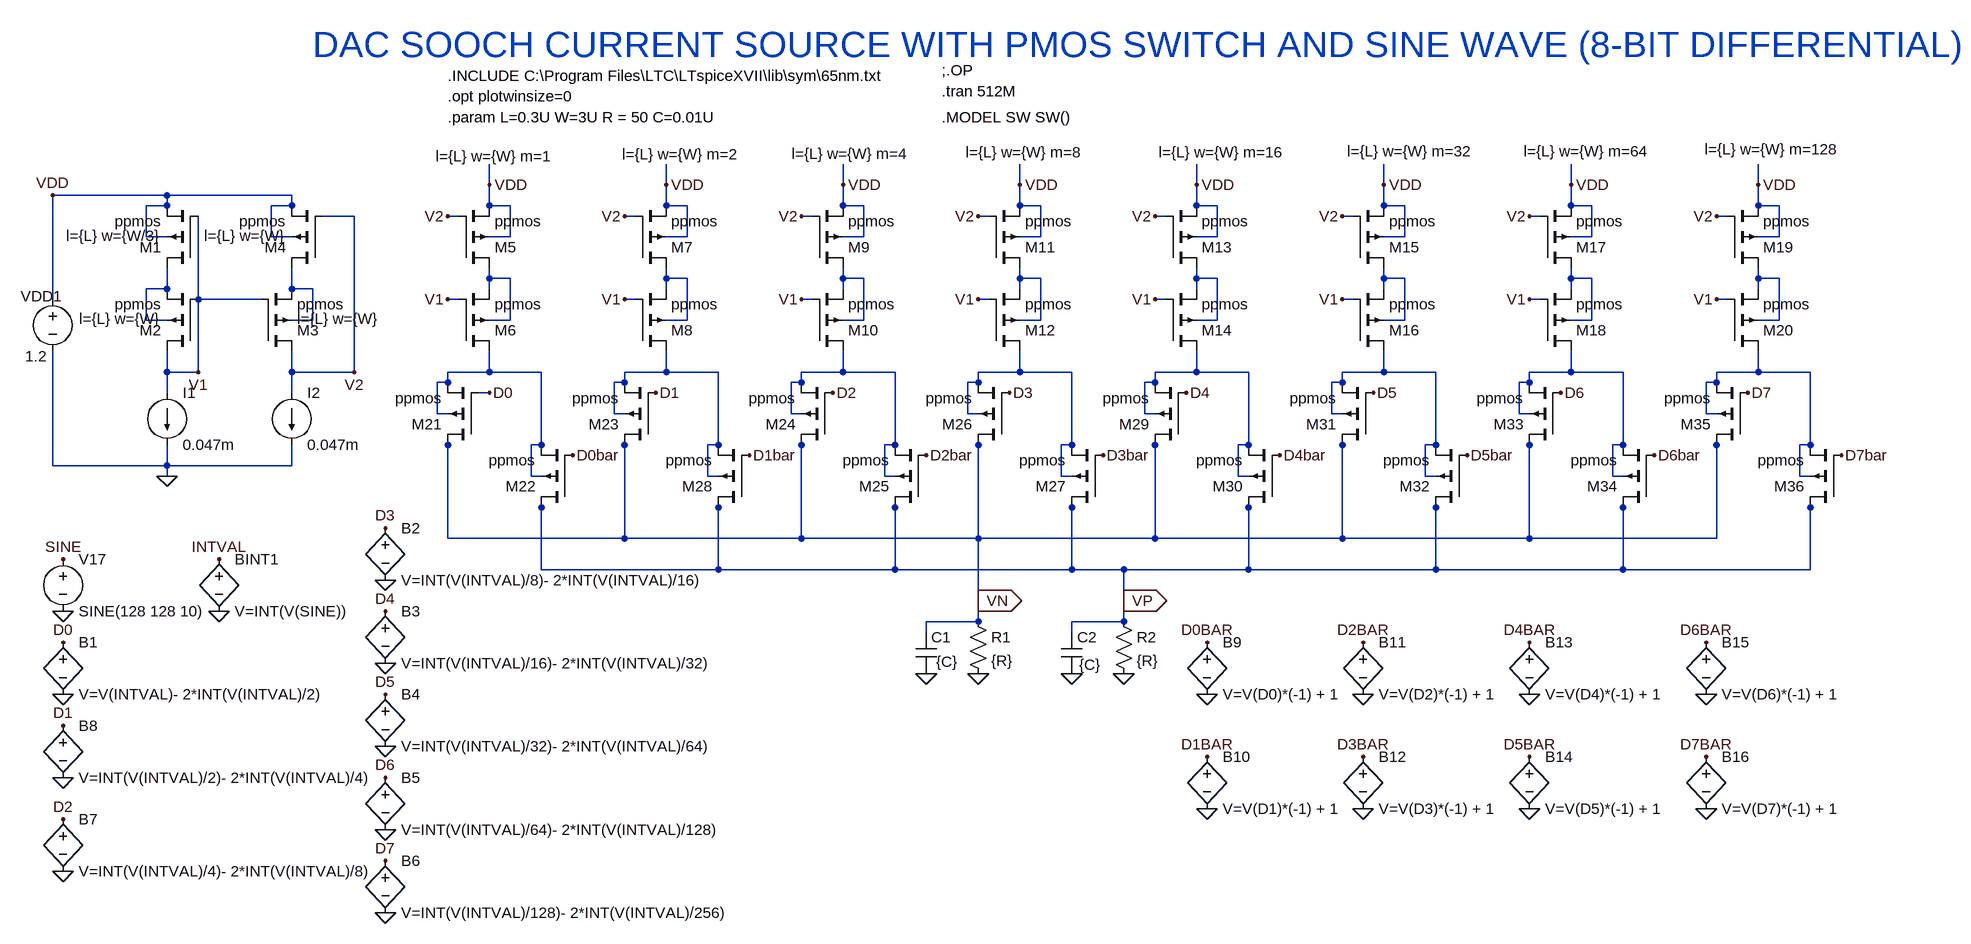
[diagram p0: schematic 107DAC_DIFF_SOOCH_PMOS_SW_SINE_8BIT.asc]
107DAC_DIFF_SOOCH_PMOS_SW_SINE_8BIT.asc, the LTspice schematic file:
Version 4
SHEET 1 1344 1360
WIRE -960 -448 -960 -480
WIRE -688 -448 -688 -480
WIRE -416 -448 -416 -480
WIRE -144 -448 -144 -480
WIRE 128 -448 128 -480
WIRE 416 -448 416 -480
WIRE 704 -448 704 -480
WIRE 992 -448 992 -480
WIRE -1456 -432 -1632 -432
WIRE -1264 -432 -1456 -432
WIRE -1456 -416 -1456 -432
WIRE -1456 -416 -1488 -416
WIRE -1264 -416 -1264 -432
WIRE -1264 -416 -1296 -416
WIRE -960 -416 -960 -448
WIRE -928 -416 -960 -416
WIRE -688 -416 -688 -448
WIRE -656 -416 -688 -416
WIRE -416 -416 -416 -448
WIRE -384 -416 -416 -416
WIRE -144 -416 -144 -448
WIRE -112 -416 -144 -416
WIRE 128 -416 128 -448
WIRE 160 -416 128 -416
WIRE 416 -416 416 -448
WIRE 448 -416 416 -416
WIRE 704 -416 704 -448
WIRE 736 -416 704 -416
WIRE 992 -416 992 -448
WIRE 1024 -416 992 -416
WIRE -1168 -400 -1216 -400
WIRE -1008 -400 -1024 -400
WIRE -736 -400 -752 -400
WIRE -464 -400 -480 -400
WIRE -192 -400 -208 -400
WIRE 80 -400 64 -400
WIRE 368 -400 352 -400
WIRE 656 -400 640 -400
WIRE 944 -400 928 -400
WIRE -1488 -368 -1488 -416
WIRE -1456 -368 -1488 -368
WIRE -1296 -368 -1296 -416
WIRE -1264 -368 -1296 -368
WIRE -928 -368 -928 -416
WIRE -928 -368 -960 -368
WIRE -656 -368 -656 -416
WIRE -656 -368 -688 -368
WIRE -384 -368 -384 -416
WIRE -384 -368 -416 -368
WIRE -112 -368 -112 -416
WIRE -112 -368 -144 -368
WIRE 160 -368 160 -416
WIRE 160 -368 128 -368
WIRE 448 -368 448 -416
WIRE 448 -368 416 -368
WIRE 736 -368 736 -416
WIRE 736 -368 704 -368
WIRE 1024 -368 1024 -416
WIRE 1024 -368 992 -368
WIRE -960 -304 -960 -320
WIRE -928 -304 -960 -304
WIRE -688 -304 -688 -320
WIRE -656 -304 -688 -304
WIRE -416 -304 -416 -320
WIRE -384 -304 -416 -304
WIRE -144 -304 -144 -320
WIRE -112 -304 -144 -304
WIRE 128 -304 128 -320
WIRE 160 -304 128 -304
WIRE 416 -304 416 -320
WIRE 448 -304 416 -304
WIRE 704 -304 704 -320
WIRE 736 -304 704 -304
WIRE 992 -304 992 -320
WIRE 1024 -304 992 -304
WIRE -1456 -288 -1456 -320
WIRE -1456 -288 -1488 -288
WIRE -1264 -288 -1264 -320
WIRE -1232 -288 -1264 -288
WIRE -960 -288 -960 -304
WIRE -688 -288 -688 -304
WIRE -416 -288 -416 -304
WIRE -144 -288 -144 -304
WIRE 128 -288 128 -304
WIRE 416 -288 416 -304
WIRE 704 -288 704 -304
WIRE 992 -288 992 -304
WIRE -1632 -272 -1632 -432
WIRE -1408 -272 -1408 -400
WIRE -1312 -272 -1408 -272
WIRE -1008 -272 -1024 -272
WIRE -736 -272 -752 -272
WIRE -464 -272 -480 -272
WIRE -192 -272 -208 -272
WIRE 80 -272 64 -272
WIRE 368 -272 352 -272
WIRE 656 -272 640 -272
WIRE 944 -272 928 -272
WIRE -1488 -240 -1488 -288
WIRE -1456 -240 -1488 -240
WIRE -1232 -240 -1232 -288
WIRE -1232 -240 -1264 -240
WIRE -928 -240 -928 -304
WIRE -928 -240 -960 -240
WIRE -656 -240 -656 -304
WIRE -656 -240 -688 -240
WIRE -384 -240 -384 -304
WIRE -384 -240 -416 -240
WIRE -112 -240 -112 -304
WIRE -112 -240 -144 -240
WIRE 160 -240 160 -304
WIRE 160 -240 128 -240
WIRE 448 -240 448 -304
WIRE 448 -240 416 -240
WIRE 736 -240 736 -304
WIRE 736 -240 704 -240
WIRE 1024 -240 1024 -304
WIRE 1024 -240 992 -240
WIRE -1456 -160 -1456 -192
WIRE -1408 -160 -1408 -272
WIRE -1408 -160 -1456 -160
WIRE -1264 -160 -1264 -192
WIRE -1168 -160 -1168 -400
WIRE -1168 -160 -1264 -160
WIRE -960 -160 -960 -192
WIRE -960 -160 -1024 -160
WIRE -880 -160 -960 -160
WIRE -688 -160 -688 -192
WIRE -688 -160 -752 -160
WIRE -608 -160 -688 -160
WIRE -416 -160 -416 -192
WIRE -416 -160 -480 -160
WIRE -336 -160 -416 -160
WIRE -144 -160 -144 -192
WIRE -144 -160 -208 -160
WIRE -64 -160 -144 -160
WIRE 128 -160 128 -192
WIRE 128 -160 64 -160
WIRE 208 -160 128 -160
WIRE 416 -160 416 -192
WIRE 416 -160 352 -160
WIRE 496 -160 416 -160
WIRE 704 -160 704 -192
WIRE 704 -160 640 -160
WIRE 784 -160 704 -160
WIRE 992 -160 992 -192
WIRE 992 -160 928 -160
WIRE 1072 -160 992 -160
WIRE -1024 -144 -1024 -160
WIRE -1024 -144 -1040 -144
WIRE -752 -144 -752 -160
WIRE -752 -144 -768 -144
WIRE -480 -144 -480 -160
WIRE -480 -144 -496 -144
WIRE -208 -144 -208 -160
WIRE -208 -144 -224 -144
WIRE 64 -144 64 -160
WIRE 64 -144 48 -144
WIRE 352 -144 352 -160
WIRE 352 -144 336 -144
WIRE 640 -144 640 -160
WIRE 640 -144 624 -144
WIRE 928 -144 928 -160
WIRE 928 -144 912 -144
WIRE -1456 -128 -1456 -160
WIRE -1264 -128 -1264 -160
WIRE -960 -128 -976 -128
WIRE -1040 -96 -1040 -144
WIRE -1024 -96 -1040 -96
WIRE -768 -96 -768 -144
WIRE -752 -96 -768 -96
WIRE -496 -96 -496 -144
WIRE -480 -96 -496 -96
WIRE -224 -96 -224 -144
WIRE -208 -96 -224 -96
WIRE 48 -96 48 -144
WIRE 64 -96 48 -96
WIRE 336 -96 336 -144
WIRE 352 -96 336 -96
WIRE 624 -96 624 -144
WIRE 640 -96 624 -96
WIRE 912 -96 912 -144
WIRE 928 -96 912 -96
WIRE -1024 -48 -1024 -64
WIRE -880 -48 -880 -160
WIRE -880 -48 -896 -48
WIRE -752 -48 -752 -64
WIRE -608 -48 -608 -160
WIRE -608 -48 -624 -48
WIRE -480 -48 -480 -64
WIRE -336 -48 -336 -160
WIRE -336 -48 -352 -48
WIRE -208 -48 -208 -64
WIRE -64 -48 -64 -160
WIRE -64 -48 -80 -48
WIRE 64 -48 64 -64
WIRE 208 -48 208 -160
WIRE 208 -48 192 -48
WIRE 352 -48 352 -64
WIRE 496 -48 496 -160
WIRE 496 -48 480 -48
WIRE 640 -48 640 -64
WIRE 784 -48 784 -160
WIRE 784 -48 768 -48
WIRE 928 -48 928 -64
WIRE 1072 -48 1072 -160
WIRE 1072 -48 1056 -48
WIRE -1632 -16 -1632 -192
WIRE -1456 -16 -1456 -48
WIRE -1456 -16 -1632 -16
WIRE -1264 -16 -1264 -48
WIRE -1264 -16 -1456 -16
WIRE -1456 0 -1456 -16
WIRE -896 0 -896 -48
WIRE -880 0 -896 0
WIRE -624 0 -624 -48
WIRE -608 0 -624 0
WIRE -352 0 -352 -48
WIRE -336 0 -352 0
WIRE -80 0 -80 -48
WIRE -64 0 -80 0
WIRE 192 0 192 -48
WIRE 208 0 192 0
WIRE 480 0 480 -48
WIRE 496 0 480 0
WIRE 768 0 768 -48
WIRE 784 0 768 0
WIRE 1056 0 1056 -48
WIRE 1072 0 1056 0
WIRE -880 48 -880 32
WIRE -608 48 -608 32
WIRE -336 48 -336 32
WIRE -64 48 -64 32
WIRE 208 48 208 32
WIRE 496 48 496 32
WIRE 784 48 784 32
WIRE 1072 48 1072 32
WIRE -1024 96 -1024 -48
WIRE -752 96 -752 -48
WIRE -752 96 -1024 96
WIRE -480 96 -480 -48
WIRE -480 96 -752 96
WIRE -208 96 -208 -48
WIRE -208 96 -480 96
WIRE 64 96 64 -48
WIRE 64 96 -208 96
WIRE 352 96 352 -48
WIRE 352 96 64 96
WIRE 640 96 640 -48
WIRE 640 96 352 96
WIRE 928 96 928 -48
WIRE 928 96 640 96
WIRE -880 144 -880 48
WIRE -608 144 -608 48
WIRE -608 144 -880 144
WIRE -336 144 -336 48
WIRE -336 144 -608 144
WIRE -64 144 -64 48
WIRE -64 144 -336 144
WIRE 16 144 -64 144
WIRE 208 144 208 48
WIRE 208 144 16 144
WIRE 496 144 496 48
WIRE 496 144 208 144
WIRE 784 144 784 48
WIRE 784 144 496 144
WIRE 1072 144 1072 48
WIRE 1072 144 784 144
WIRE -208 192 -208 96
WIRE 16 192 16 144
WIRE -208 224 -208 192
WIRE -208 224 -288 224
WIRE 16 224 16 192
WIRE 16 224 -64 224
WIRE -288 240 -288 224
WIRE -64 240 -64 224
FLAG -1408 -160 V1
FLAG -1024 -272 V1
FLAG -1168 -160 V2
FLAG -1024 -400 V2
FLAG -960 -448 VDD
FLAG -1632 -432 VDD
FLAG -752 -272 V1
FLAG -752 -400 V2
FLAG -688 -448 VDD
FLAG -480 -272 V1
FLAG -480 -400 V2
FLAG -416 -448 VDD
FLAG -208 -272 V1
FLAG -208 -400 V2
FLAG -144 -448 VDD
FLAG 64 -272 V1
FLAG 64 -400 V2
FLAG 128 -448 VDD
FLAG 352 -272 V1
FLAG 352 -400 V2
FLAG 416 -448 VDD
FLAG 640 -272 V1
FLAG 640 -400 V2
FLAG 704 -448 VDD
FLAG 928 -272 V1
FLAG 928 -400 V2
FLAG 992 -448 VDD
FLAG -208 304 0
FLAG -704 -128 D1
FLAG -432 -128 D2
FLAG -160 -128 D3
FLAG 112 -128 D4
FLAG 400 -128 D5
FLAG 688 -128 D6
FLAG 976 -128 D7
FLAG -1456 0 0
FLAG -288 304 0
FLAG -832 -32 D0bar
FLAG -560 -32 D1bar
FLAG -288 -32 D2bar
FLAG -16 -32 D3bar
FLAG 256 -32 D4bar
FLAG 544 -32 D5bar
FLAG 832 -32 D6bar
FLAG 1120 -32 D7bar
FLAG 16 304 0
FLAG 16 192 VP
IOPIN 16 192 Out
FLAG -64 304 0
FLAG -208 192 VN
IOPIN -208 192 Out
FLAG -960 -128 D0
FLAG -1616 208 0
FLAG -1616 128 SINE
FLAG -1376 208 0
FLAG -1376 128 INTVAL
FLAG -1616 256 D0
FLAG -1616 336 0
FLAG -1616 384 D1
FLAG -1616 528 D2
FLAG -1120 80 D3
FLAG -1120 208 D4
FLAG -1120 336 D5
FLAG -1120 464 D6
FLAG -1120 592 D7
FLAG -1120 160 0
FLAG -1120 288 0
FLAG -1120 416 0
FLAG -1120 544 0
FLAG -1120 672 0
FLAG -1616 608 0
FLAG -1616 464 0
FLAG 144 336 0
FLAG 144 256 D0BAR
FLAG 144 512 0
FLAG 144 432 D1BAR
FLAG 384 336 0
FLAG 384 256 D2BAR
FLAG 384 512 0
FLAG 384 432 D3BAR
FLAG 640 336 0
FLAG 640 256 D4BAR
FLAG 640 512 0
FLAG 640 432 D5BAR
FLAG 912 336 0
FLAG 912 256 D6BAR
FLAG 912 512 0
FLAG 912 432 D7BAR
SYMBOL pmos4 -1408 -320 R180
WINDOW 123 56 50 Left 2
SYMATTR Value2 l={L} w={W/3}
SYMATTR InstName M1
SYMATTR Value ppmos
SYMBOL pmos4 -1408 -192 R180
WINDOW 123 56 50 Left 2
SYMATTR Value2 l={L} w={W}
SYMATTR InstName M2
SYMATTR Value ppmos
SYMBOL current -1456 -128 R0
WINDOW 123 0 0 Left 0
WINDOW 39 0 0 Left 0
SYMATTR InstName I1
SYMATTR Value 0.047m
SYMBOL pmos4 -1312 -192 M180
WINDOW 123 56 50 Left 2
SYMATTR Value2 l={L} w={W}
SYMATTR InstName M3
SYMATTR Value ppmos
SYMBOL pmos4 -1216 -320 R180
WINDOW 123 56 50 Left 2
SYMATTR Value2 l={L} w={W}
SYMATTR InstName M4
SYMATTR Value ppmos
SYMBOL current -1264 -128 R0
WINDOW 123 0 0 Left 0
WINDOW 39 0 0 Left 0
SYMATTR InstName I2
SYMATTR Value 0.047m
SYMBOL pmos4 -1008 -320 M180
WINDOW 123 -35 172 Left 2
SYMATTR Value2 l={L} w={W} m=1
SYMATTR InstName M5
SYMATTR Value ppmos
SYMBOL pmos4 -1008 -192 M180
SYMATTR Value2 l={L} w={W} m=1
SYMATTR InstName M6
SYMATTR Value ppmos
SYMBOL voltage -1632 -288 R0
WINDOW 123 0 0 Left 0
WINDOW 39 0 0 Left 0
WINDOW 0 -49 11 Left 2
WINDOW 3 -42 104 Left 2
SYMATTR InstName VDD1
SYMATTR Value 1.2
SYMBOL pmos4 -736 -320 M180
WINDOW 123 -20 175 Left 2
SYMATTR Value2 l={L} w={W} m=2
SYMATTR InstName M7
SYMATTR Value ppmos
SYMBOL pmos4 -736 -192 M180
SYMATTR Value2 l={L} w={W} m=2
SYMATTR InstName M8
SYMATTR Value ppmos
SYMBOL pmos4 -464 -320 M180
WINDOW 123 -31 176 Left 2
SYMATTR Value2 l={L} w={W} m=4
SYMATTR InstName M9
SYMATTR Value ppmos
SYMBOL pmos4 -464 -192 M180
SYMATTR Value2 l={L} w={W} m=4
SYMATTR InstName M10
SYMATTR Value ppmos
SYMBOL pmos4 -192 -320 M180
WINDOW 123 -35 178 Left 2
SYMATTR Value2 l={L} w={W} m=8
SYMATTR InstName M11
SYMATTR Value ppmos
SYMBOL pmos4 -192 -192 M180
SYMATTR Value2 l={L} w={W} m=8
SYMATTR InstName M12
SYMATTR Value ppmos
SYMBOL pmos4 80 -320 M180
WINDOW 123 -10 178 Left 2
SYMATTR Value2 l={L} w={W} m=16
SYMATTR InstName M13
SYMATTR Value ppmos
SYMBOL pmos4 80 -192 M180
SYMATTR Value2 l={L} w={W} m=16
SYMATTR InstName M14
SYMATTR Value ppmos
SYMBOL pmos4 368 -320 M180
WINDOW 123 -8 180 Left 2
SYMATTR Value2 l={L} w={W} m=32
SYMATTR InstName M15
SYMATTR Value ppmos
SYMBOL pmos4 368 -192 M180
SYMATTR Value2 l={L} w={W} m=32
SYMATTR InstName M16
SYMATTR Value ppmos
SYMBOL pmos4 656 -320 M180
WINDOW 123 -25 180 Left 2
SYMATTR Value2 l={L} w={W} m=64
SYMATTR InstName M17
SYMATTR Value ppmos
SYMBOL pmos4 656 -192 M180
SYMATTR Value2 l={L} w={W} m=64
SYMATTR InstName M18
SYMATTR Value ppmos
SYMBOL pmos4 944 -320 M180
WINDOW 123 -34 183 Left 2
SYMATTR Value2 l={L} w={W} m=128
SYMATTR InstName M19
SYMATTR Value ppmos
SYMBOL pmos4 944 -192 M180
SYMATTR Value2 l={L} w={W} m=128
SYMATTR InstName M20
SYMATTR Value ppmos
SYMBOL res -224 208 R0
SYMATTR InstName R1
SYMATTR Value {R}
SYMBOL cap -304 240 R0
WINDOW 3 31 46 Left 2
SYMATTR Value {C}
SYMATTR InstName C1
SYMBOL res 0 208 R0
SYMATTR InstName R2
SYMATTR Value {R}
SYMBOL cap -80 240 R0
WINDOW 3 27 50 Left 2
SYMATTR Value {C}
SYMATTR InstName C2
SYMBOL pmos4 -976 -48 R180
SYMATTR Value2 l={L} w={W} m=1
SYMATTR InstName M21
SYMATTR Value ppmos
SYMBOL pmos4 -832 48 R180
SYMATTR Value2 l={L} w={W} m=1
SYMATTR InstName M22
SYMATTR Value ppmos
SYMBOL pmos4 -704 -48 R180
SYMATTR Value2 l={L} w={W} m=2
SYMATTR InstName M23
SYMATTR Value ppmos
SYMBOL pmos4 -432 -48 R180
SYMATTR Value2 l={L} w={W} m=4
SYMATTR InstName M24
SYMATTR Value ppmos
SYMBOL pmos4 -288 48 R180
SYMATTR Value2 l={L} w={W} m=4
SYMATTR InstName M25
SYMATTR Value ppmos
SYMBOL pmos4 -160 -48 R180
SYMATTR Value2 l={L} w={W} m=8
SYMATTR InstName M26
SYMATTR Value ppmos
SYMBOL pmos4 -16 48 R180
SYMATTR Value2 l={L} w={W} m=8
SYMATTR InstName M27
SYMATTR Value ppmos
SYMBOL pmos4 -560 48 R180
SYMATTR Value2 l={L} w={W} m=2
SYMATTR InstName M28
SYMATTR Value ppmos
SYMBOL pmos4 112 -48 R180
SYMATTR Value2 l={L} w={W} m=16
SYMATTR InstName M29
SYMATTR Value ppmos
SYMBOL pmos4 256 48 R180
SYMATTR Value2 l={L} w={W} m=16
SYMATTR InstName M30
SYMATTR Value ppmos
SYMBOL pmos4 400 -48 R180
SYMATTR Value2 l={L} w={W} m=32
SYMATTR InstName M31
SYMATTR Value ppmos
SYMBOL pmos4 544 48 R180
SYMATTR Value2 l={L} w={W} m=32
SYMATTR InstName M32
SYMATTR Value ppmos
SYMBOL pmos4 688 -48 R180
SYMATTR Value2 l={L} w={W} m=64
SYMATTR InstName M33
SYMATTR Value ppmos
SYMBOL pmos4 832 48 R180
SYMATTR Value2 l={L} w={W} m=64
SYMATTR InstName M34
SYMATTR Value ppmos
SYMBOL pmos4 976 -48 R180
SYMATTR Value2 l={L} w={W} m=128
SYMATTR InstName M35
SYMATTR Value ppmos
SYMBOL pmos4 1120 48 R180
SYMATTR Value2 l={L} w={W} m=128
SYMATTR InstName M36
SYMATTR Value ppmos
SYMBOL voltage -1616 112 R0
WINDOW 123 0 0 Left 0
WINDOW 39 0 0 Left 0
SYMATTR InstName V17
SYMATTR Value SINE(128 128 10)
SYMBOL bv -1376 112 R0
SYMATTR InstName BINT1
SYMATTR Value V=INT(V(SINE))
SYMBOL bv -1616 240 R0
SYMATTR InstName B1
SYMATTR Value V=V(INTVAL)- 2*INT(V(INTVAL)/2)
SYMBOL bv -1120 64 R0
SYMATTR InstName B2
SYMATTR Value V=INT(V(INTVAL)/8)- 2*INT(V(INTVAL)/16)
SYMBOL bv -1120 192 R0
SYMATTR InstName B3
SYMATTR Value V=INT(V(INTVAL)/16)- 2*INT(V(INTVAL)/32)
SYMBOL bv -1120 320 R0
SYMATTR InstName B4
SYMATTR Value V=INT(V(INTVAL)/32)- 2*INT(V(INTVAL)/64)
SYMBOL bv -1120 448 R0
SYMATTR InstName B5
SYMATTR Value V=INT(V(INTVAL)/64)- 2*INT(V(INTVAL)/128)
SYMBOL bv -1120 576 R0
SYMATTR InstName B6
SYMATTR Value V=INT(V(INTVAL)/128)- 2*INT(V(INTVAL)/256)
SYMBOL bv -1616 512 R0
SYMATTR InstName B7
SYMATTR Value V=INT(V(INTVAL)/4)- 2*INT(V(INTVAL)/8)
SYMBOL bv -1616 368 R0
SYMATTR InstName B8
SYMATTR Value V=INT(V(INTVAL)/2)- 2*INT(V(INTVAL)/4)
SYMBOL bv 144 240 R0
SYMATTR InstName B9
SYMATTR Value V=V(D0)*(-1) + 1
SYMBOL bv 144 416 R0
SYMATTR InstName B10
SYMATTR Value V=V(D1)*(-1) + 1
SYMBOL bv 384 240 R0
SYMATTR InstName B11
SYMATTR Value V=V(D2)*(-1) + 1
SYMBOL bv 384 416 R0
SYMATTR InstName B12
SYMATTR Value V=V(D3)*(-1) + 1
SYMBOL bv 640 240 R0
SYMATTR InstName B13
SYMATTR Value V=V(D4)*(-1) + 1
SYMBOL bv 640 416 R0
SYMATTR InstName B14
SYMATTR Value V=V(D5)*(-1) + 1
SYMBOL bv 912 240 R0
SYMATTR InstName B15
SYMATTR Value V=V(D6)*(-1) + 1
SYMBOL bv 912 416 R0
SYMATTR InstName B16
SYMATTR Value V=V(D7)*(-1) + 1
TEXT -1024 -616 Left 2 !.INCLUDE C:\\Program Files\\LTC\\LTspiceXVII\\lib\\sym\\65nm.txt
TEXT -1024 -584 Left 2 !.opt plotwinsize=0
TEXT -264 -624 Left 2 !;.OP
TEXT -1024 -552 Left 2 !.param L=0.3U W=3U R = 50 C=0.01U
TEXT -264 -592 Left 2 !.tran 512M
TEXT -264 -552 Left 2 !.MODEL SW SW()
TEXT -1232 -664 Left 5 ;DAC SOOCH CURRENT SOURCE WITH PMOS SWITCH AND SINE WAVE (8-BIT DIFFERENTIAL)

The netlist it stands for:
* 107DAC_DIFF_SOOCH_PMOS_SW_SINE_8BIT.asc
M1 N009 V1 VDD VDD ppmos l={L} w={W/3}
M2 V1 V1 N009 N009 ppmos l={L} w={W}
I1 V1 0 0.047m
M3 V2 V1 N010 N010 ppmos l={L} w={W}
M4 N010 V2 VDD VDD ppmos l={L} w={W}
I2 V2 0 0.047m
M5 N001 V2 VDD VDD ppmos l={L} w={W} m=1
M6 N011 V1 N001 N001 ppmos l={L} w={W} m=1
VDD1 VDD 0 1.2
M7 N002 V2 VDD VDD ppmos l={L} w={W} m=2
M8 N012 V1 N002 N002 ppmos l={L} w={W} m=2
M9 N003 V2 VDD VDD ppmos l={L} w={W} m=4
M10 N013 V1 N003 N003 ppmos l={L} w={W} m=4
M11 N004 V2 VDD VDD ppmos l={L} w={W} m=8
M12 N014 V1 N004 N004 ppmos l={L} w={W} m=8
M13 N005 V2 VDD VDD ppmos l={L} w={W} m=16
M14 N015 V1 N005 N005 ppmos l={L} w={W} m=16
M15 N006 V2 VDD VDD ppmos l={L} w={W} m=32
M16 N016 V1 N006 N006 ppmos l={L} w={W} m=32
M17 N007 V2 VDD VDD ppmos l={L} w={W} m=64
M18 N017 V1 N007 N007 ppmos l={L} w={W} m=64
M19 N008 V2 VDD VDD ppmos l={L} w={W} m=128
M20 N018 V1 N008 N008 ppmos l={L} w={W} m=128
R1 VN 0 {R}
C1 VN 0 {C}
R2 VP 0 {R}
C2 VP 0 {C}
M21 VN D0 N011 N011 ppmos l={L} w={W} m=1
M22 VP D0bar N011 N011 ppmos l={L} w={W} m=1
M23 VN D1 N012 N012 ppmos l={L} w={W} m=2
M24 VN D2 N013 N013 ppmos l={L} w={W} m=4
M25 VP D2bar N013 N013 ppmos l={L} w={W} m=4
M26 VN D3 N014 N014 ppmos l={L} w={W} m=8
M27 VP D3bar N014 N014 ppmos l={L} w={W} m=8
M28 VP D1bar N012 N012 ppmos l={L} w={W} m=2
M29 VN D4 N015 N015 ppmos l={L} w={W} m=16
M30 VP D4bar N015 N015 ppmos l={L} w={W} m=16
M31 VN D5 N016 N016 ppmos l={L} w={W} m=32
M32 VP D5bar N016 N016 ppmos l={L} w={W} m=32
M33 VN D6 N017 N017 ppmos l={L} w={W} m=64
M34 VP D6bar N017 N017 ppmos l={L} w={W} m=64
M35 VN D7 N018 N018 ppmos l={L} w={W} m=128
M36 VP D7bar N018 N018 ppmos l={L} w={W} m=128
V17 SINE 0 SINE(128 128 10)
BINT1 INTVAL 0 V=INT(V(SINE))
B1 D0 0 V=V(INTVAL)- 2*INT(V(INTVAL)/2)
B2 D3 0 V=INT(V(INTVAL)/8)- 2*INT(V(INTVAL)/16)
B3 D4 0 V=INT(V(INTVAL)/16)- 2*INT(V(INTVAL)/32)
B4 D5 0 V=INT(V(INTVAL)/32)- 2*INT(V(INTVAL)/64)
B5 D6 0 V=INT(V(INTVAL)/64)- 2*INT(V(INTVAL)/128)
B6 D7 0 V=INT(V(INTVAL)/128)- 2*INT(V(INTVAL)/256)
B7 D2 0 V=INT(V(INTVAL)/4)- 2*INT(V(INTVAL)/8)
B8 D1 0 V=INT(V(INTVAL)/2)- 2*INT(V(INTVAL)/4)
B9 D0bar 0 V=V(D0)*(-1) + 1
B10 D1bar 0 V=V(D1)*(-1) + 1
B11 D2bar 0 V=V(D2)*(-1) + 1
B12 D3bar 0 V=V(D3)*(-1) + 1
B13 D4bar 0 V=V(D4)*(-1) + 1
B14 D5bar 0 V=V(D5)*(-1) + 1
B15 D6bar 0 V=V(D6)*(-1) + 1
B16 D7bar 0 V=V(D7)*(-1) + 1
.model NMOS NMOS
.model PMOS PMOS
.lib standard.mos
.INCLUDE C:\Program Files\LTC\LTspiceXVII\lib\sym\65nm.txt
.opt plotwinsize=0
;.OP
.param L=0.3U W=3U R = 50 C=0.01U
.tran 512M
.MODEL SW SW()
* DAC SOOCH CURRENT SOURCE WITH PMOS SWITCH AND SINE WAVE (8-BIT DIFFERENTIAL)
.backanno
.end